# EAGLE design Main (EAGLE 9.5.2)
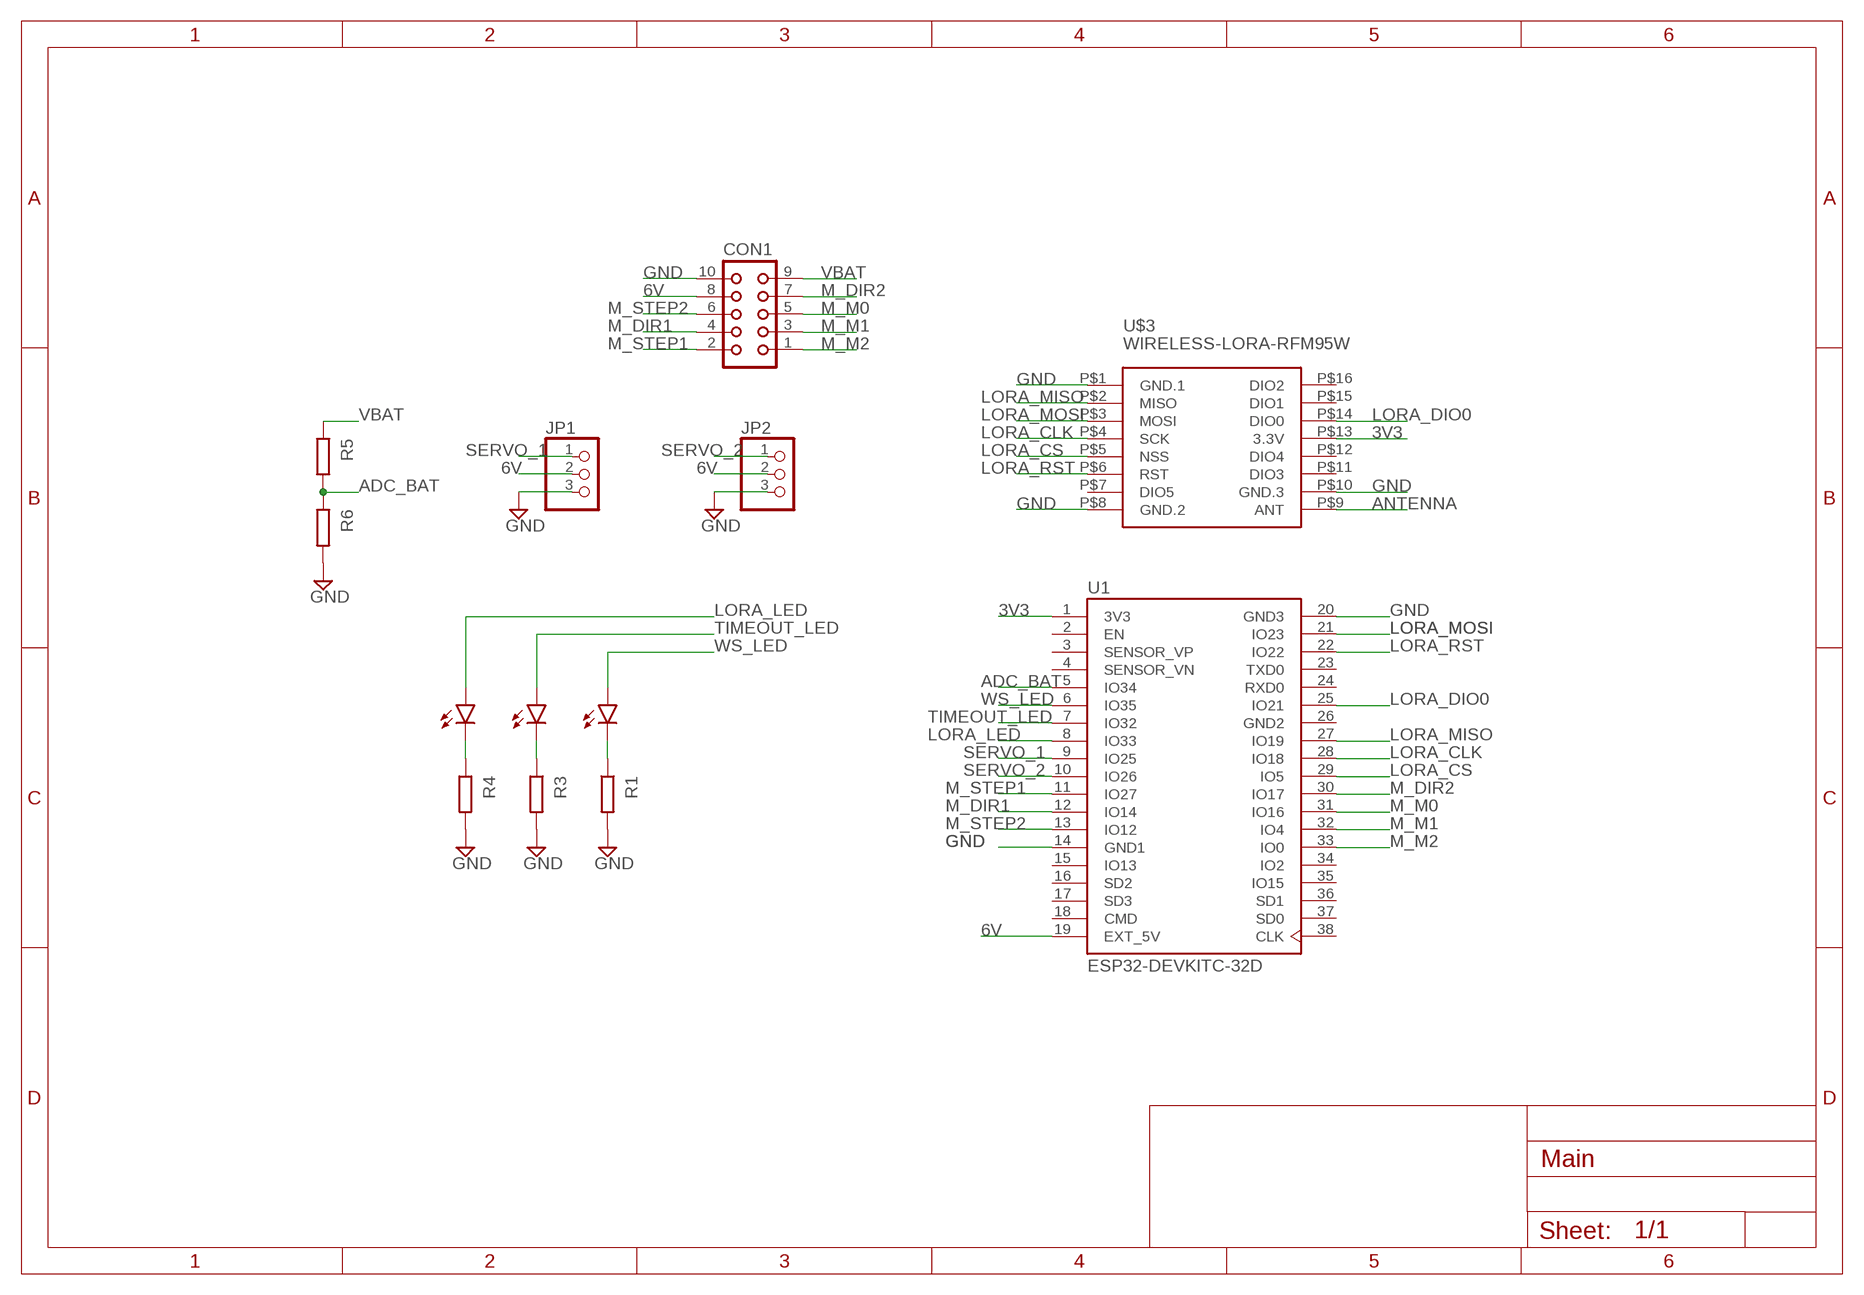
[diagram p0: schematic, sheet 1]

## Parts
CON1  CON10  [CON10]
JP1  PINHD-1X3  [1X03]
JP2  PINHD-1X3  [1X03]
LORA  LED_BLUE  [LEDRD254W60D565H860B_B]
MV  LED_BLUE  [LEDRD254W60D565H860B_B]
R1  R_CHIP-0603(1608-METRIC)  [RESC1608X60]
R3  R_CHIP-0603(1608-METRIC)  [RESC1608X60]
R4  R_CHIP-0603(1608-METRIC)  [RESC1608X60]
R5  R_CHIP-0603(1608-METRIC)  [RESC1608X60]
R6  R_CHIP-0603(1608-METRIC)  [RESC1608X60]
TOUT  LED_BLUE  [LEDRD254W60D565H860B_B]
U1  ESP32-DEVKITC-32D  [MODULE_ESP32-DEVKITC-32D]
U$3  WIRELESS-LORA-RFM95W  [LORA-BREAKOUT]

## Nets
3V3: U1.1(3V3) U$3.P$13(3.3V)
6V: CON1.8 JP1.2 JP2.2 U1.19(EXT_5V)
ADC_BAT: R5.2 R6.1 U1.5(IO34)
ANTENNA: U$3.P$9(ANT)
GND: CON1.10 JP1.3 JP2.3 R1.2 R3.2 R4.2 R6.2 U1.14(GND1) U1.20(GND3) U$3.P$1(GND.1) U$3.P$8(GND.2) U$3.P$10(GND.3)
LORA_CLK: U1.28(IO18) U$3.P$4(SCK)
LORA_CS: U1.29(IO5) U$3.P$5(NSS)
LORA_DIO0: U1.25(IO21) U$3.P$14(DIO0)
LORA_LED: MV.1(A) U1.8(IO33)
LORA_MISO: U1.27(IO19) U$3.P$2(MISO)
LORA_MOSI: U1.21(IO23) U$3.P$3(MOSI)
LORA_RST: U1.22(IO22) U$3.P$6(RST)
M_DIR1: CON1.4 U1.12(IO14)
M_DIR2: CON1.7 U1.30(IO17)
M_M0: CON1.5 U1.31(IO16)
M_M1: CON1.3 U1.32(IO4)
M_M2: CON1.1 U1.33(IO0)
M_STEP1: CON1.2 U1.11(IO27)
M_STEP2: CON1.6 U1.13(IO12)
N$1: R3.1 TOUT.2(C)
N$2: MV.2(C) R4.1
N$3: LORA.2(C) R1.1
SERVO_1: JP1.1 U1.9(IO25)
SERVO_2: JP2.1 U1.10(IO26)
TIMEOUT_LED: TOUT.1(A) U1.7(IO32)
VBAT: CON1.9 R5.1
WS_LED: LORA.1(A) U1.6(IO35)
Unconnected: U1.2(EN) U1.3(SENSOR_VP) U1.4(SENSOR_VN) U1.15(IO13) U1.16(SD2) U1.17(SD3) U1.18(CMD) U1.23(TXD0) U1.24(RXD0) U1.34(IO2) U1.35(IO15) U1.36(SD1) U1.37(SD0) U1.38(CLK) U$3.P$7(DIO5) U$3.P$11(DIO3) U$3.P$12(DIO4) U$3.P$15(DIO1) U$3.P$16(DIO2)

## Power pins joined to a net without a drawn wire
GND2: U1.26(GND2)

## Library data of the parts
CON1 = con-harting:CON10: CONNECTOR; OC_FARNELL: unknown; OC_NEWARK: unknown
JP1 JP2 = pinhead:PINHD-1X3: PIN HEADER
LORA MV TOUT = Opto-Electronic:LED: LED - Generic; CATEGORY: Opto-Electronic; SUB-CATEGORY: LED
R1 R3-R6 = Resistor:R: Resistor Fixed - Generic; CATEGORY: Resistor; SUB-CATEGORY: Fixed
U1 = custom:ESP32-DEVKITC-32D: Eval Board For Esp-Wroom-32; AVAILABILITY: Unavailable; DESCRIPTION: - Transceiver; 802.11 b/g/n _Wi-Fi, WiFi, WLAN_, Bluetooth® Smart Ready 4.x Dual Mode For Use With ESP-WROOM-32; MF: Espressif Systems; MP: ESP32-DEVKITC-32D; PACKAGE: None; PRICE: None
U$3 = mam2020:WIRELESS-LORA-RFM95W: 868/915 MHz LoRa Radio Transceiver Module based on SX1276 chip Click here to find device on ebay.com <http://www.ebay.com/sch/RFM95W+transceiver>

## Board
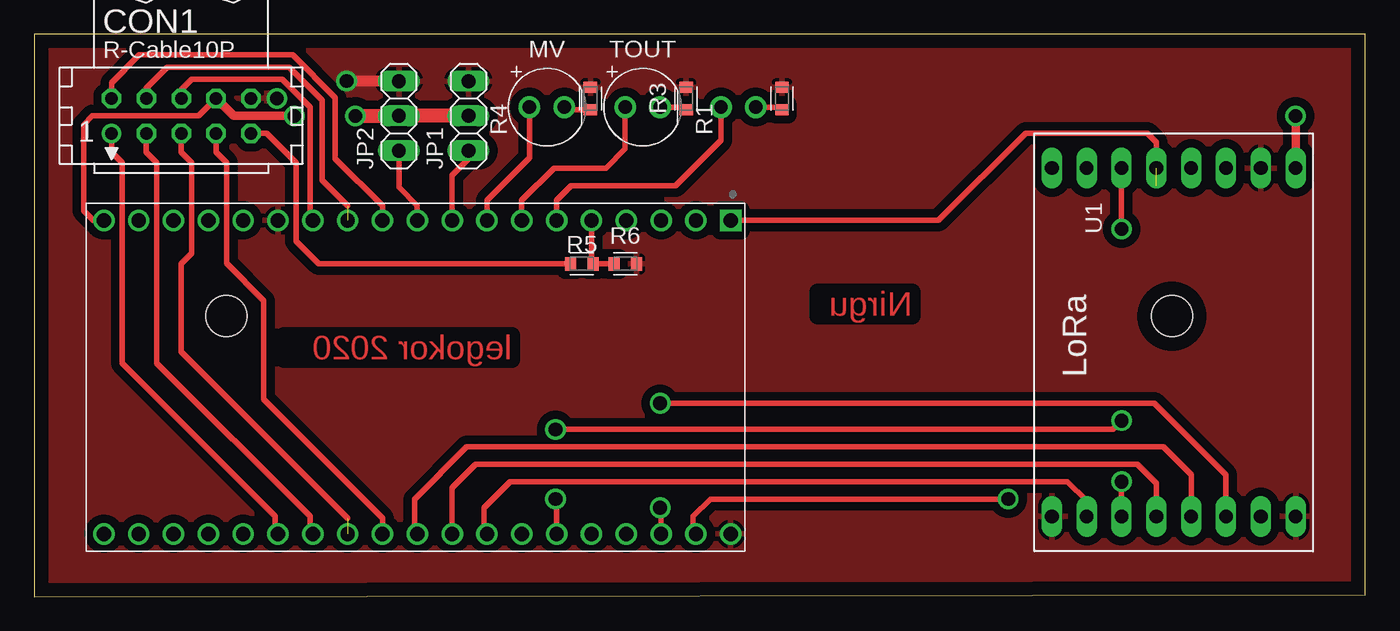
[diagram p1: board, top side]
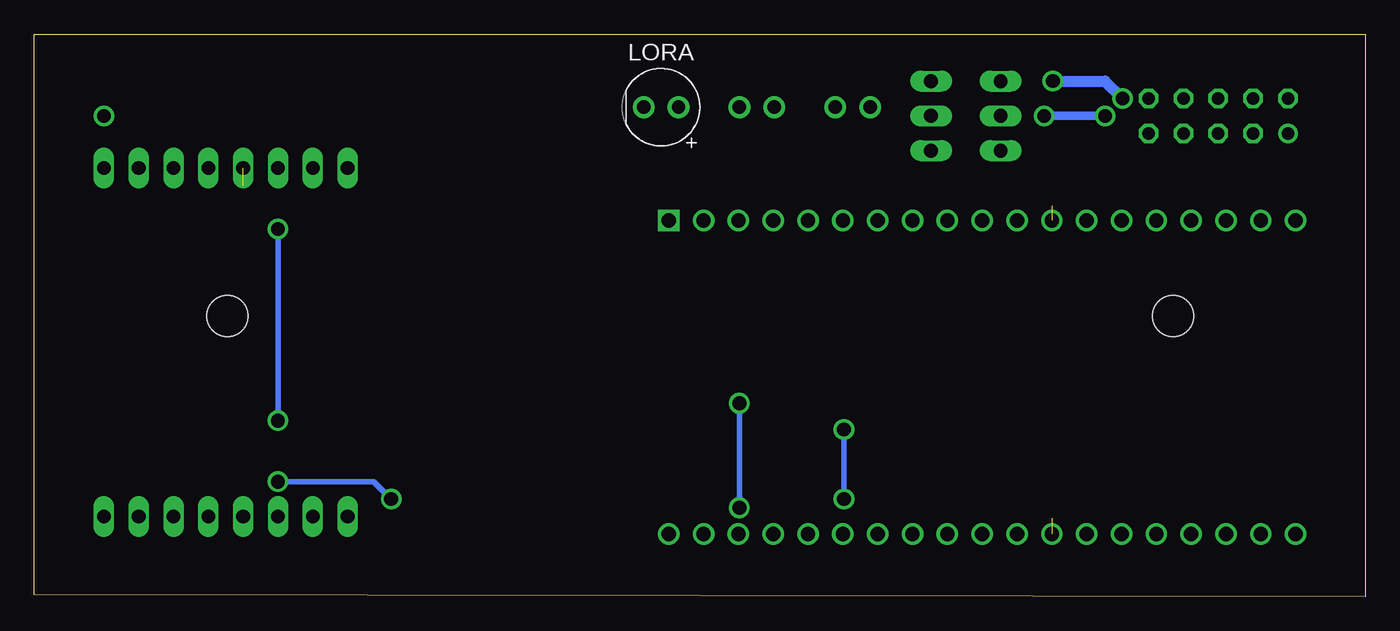
[diagram p2: board, bottom side, seen from below]

Size 97.08 x 41 mm. Coordinates in mm from the lower left corner, seen from the top.
Outline: 97.08,0.13 97.08,41 0,41 0,0 97.08,0.13
Copper layers (1*16): Top 0.035mm / dielectric 1.5mm / Bottom 0.035mm
Design rules "default": minimum track width 6mil, minimum drill 0.35mm, track to track 6mil, track to pad 6mil, pad to pad 6mil, via to via 6mil, smd to smd 6mil, copper to edge 40mil, drill to drill 6mil, minimum pad ring 10mil, minimum via ring 8mil, stop-mask expansion 4mil, vias tented up to drill 0mil, thermal gap 10mil
Holes 3 mm at 14.02,20.45 82.98,20.45

### Footprints (pad centres in the part's own frame; a part is rotated, then mirrored left to right if it is on the bottom)
CON10 = drill 0.914: 1 -5.08,-1.27 | drill 0.914 octagon: 2 -5.08,1.27; 3 -2.54,-1.27; 4 -2.54,1.27; 5 0,-1.27; 6 0,1.27; 7 2.54,-1.27; 8 2.54,1.27; 9 5.08,-1.27; 10 5.08,1.27
1X03 = drill 1.016 long: 1 -2.54,0; 2 0,0; 3 2.54,0
LEDRD254W60D565H860B_B = drill 0.981 pad 1.581: 1 -1.27,0; 2 1.27,0
RESC1608X60 = smd 0.799 x 0.974: 1 -0.815,0; 2 0.815,0
MODULE_ESP32-DEVKITC-32D = drill 1.04 square: 1 -12.7,19.76 | drill 1.04: 2 -12.7,17.22; 3 -12.7,14.68; 4 -12.7,12.14; 5 -12.7,9.6; 6 -12.7,7.06; 7 -12.7,4.52; 8 -12.7,1.98; 9 -12.7,-0.56; 10 -12.7,-3.1; 11 -12.7,-5.64; 12 -12.7,-8.18; 13 -12.7,-10.72; 14 -12.7,-13.26; 15 -12.7,-15.8; 16 -12.7,-18.34; 17 -12.7,-20.88; 18 -12.7,-23.42; 19 -12.7,-25.96; 20 10.16,19.76; 21 10.16,17.22; 22 10.16,14.68; 23 10.16,12.14; 24 10.16,9.6; 25 10.16,7.06; 26 10.16,4.52; 27 10.16,1.98; 28 10.16,-0.56; 29 10.16,-3.1; 30 10.16,-5.64; 31 10.16,-8.18; 32 10.16,-10.72; 33 10.16,-13.26; 34 10.16,-15.8; 35 10.16,-18.34; 36 10.16,-20.88; 37 10.16,-23.42; 38 10.16,-25.96
LORA-BREAKOUT = drill 1 long: P$1 -12.7,7.62; P$2 -12.7,5.08; P$3 -12.7,2.54; P$4 -12.7,0; P$5 -12.7,-2.54; P$6 -12.7,-5.08; P$7 -12.7,-7.62; P$8 -12.7,-10.16; P$9 12.7,-10.16; P$10 12.7,-7.62; P$11 12.7,-5.08; P$12 12.7,-2.54; P$13 12.7,0; P$14 12.7,2.54; P$15 12.7,5.08; P$16 12.7,7.62

### Placement (x,y rotation side)
CON1  10.72,35.05 0 top
JP1  31.67,35.05 90 top
JP2  26.59,35.05 90 top
LORA  51.36,35.69 180 bottom
MV  37.39,35.69 0 top
R1  54.53,36.32 90 top
R3  47.55,36.32 90 top
R4  40.56,36.32 90 top
R5  39.93,24.26 0 top
R6  43.1,24.26 0 top
TOUT  44.37,35.69 0 top
U1  31.04,14.73 270 top
U$3  81.84,18.54 90 top

### Tracks (layer width: path | path; a pad name or v marks a point on that pad's centre or on a via)
3V3  (1 unrouted)
  Top 0.406: U1.1 65.96,27.43 72.31,33.78 81.2,33.78 81.84,33.15 81.84,29.97
6V  (via drill 1)
  Top 0.406: U1.19 4.32,27.43 3.61,28.14 3.61,34.42 4.24,35.05 11.99,35.05 CON1.8
  Top 0.61: CON1.8 14.53,35.05 v18.97,35.05
  Top 0.813: 27.23,35.05 JP2.2
  Top 1.016: JP1.2 JP2.2 v23.42,35.05
  Bottom 0.61: v18.97,35.05 v23.42,35.05
ADC_BAT
  Top 0.406: R6.1 R5.2 40.64,24.36 U1.5
ANTENNA  (via drill 1)
  Top 0.61: U$3.P$9 v92,35.05
GND  (via drill 1)
  Top 0.813: JP2.3 v22.78,37.59
  Bottom 0.813: v22.78,37.59 18.97,37.59 v17.7,36.32
  pour Top (isolate 0.61): -0.08,0.13 -0.08,41.13 97.08,41.13 97.08,0.13
LORA_CLK
  Top 0.406: U1.28 30.48,7.95 32.18,9.65 80.44,9.65 81.84,8.26 U$3.P$4
LORA_CS
  Top 0.406: U1.29 27.74,4.77 27.74,7.11 31.55,10.92 82.35,10.92 84.38,8.89 U$3.P$5
LORA_DIO0  (via drill 1)
  Top 0.406: v79.3,12.83 78.66,12.19 v38.02,12.19 | v38.02,7.11 38.1,7.04 U1.25 | U$3.P$14 v79.3,26.8
  Bottom 0.406: v38.02,12.19 v38.02,7.11 | v79.3,26.8 v79.3,12.83
LORA_LED
  Top 0.406: U1.8 33.02,28.9 36.12,32 MV.1
LORA_MISO
  Top 0.406: U1.27 32.82,4.77 32.82,6.48 34.72,8.38 75.36,8.38 76.76,6.98 U$3.P$2
LORA_MOSI  (via drill 1)
  Top 0.406: v79.3,8.38 U$3.P$3 | U1.21 48.06,4.77 48.06,5.84 49.33,7.11 v71.04,7.11
  Bottom 0.406: v79.3,8.38 72.31,8.38 v71.04,7.11
LORA_RST  (via drill 1)
  Top 0.406: U$3.P$6 86.92,8.89 81.71,14.1 v45.64,14.1 | v45.64,6.48 45.72,6.4 U1.22
  Bottom 0.406: v45.64,14.1 v45.64,6.48
M_DIR1  (1 unrouted)
  Top 0.406: CON1.4 8.18,37.08 9.7,38.61 18.59,38.61 21.01,36.2 21.01,30.35 22.86,28.5
M_DIR2
  Top 0.406: U1.30 25.4,5.71 16.74,14.38 16.74,21.57 14.02,24.29 14.02,31.62 13.26,32.39 CON1.7
M_M0  (1 unrouted)
  Top 0.406: CON1.5 10.72,32.39 11.48,31.62 11.48,25.02 10.72,24.26 10.72,17.86 22.86,5.71
M_M1
  Top 0.406: U1.32 20.12,4.77 20.12,5.84 8.94,17.02 8.94,31.62 8.18,32.39 CON1.3
M_M2
  Top 0.406: U1.33 17.58,4.77 17.58,5.84 6.4,17.02 6.4,31.62 5.64,32.39 CON1.1
M_STEP1
  Top 0.406: U1.11 25.4,28.5 21.96,31.94 21.96,36.39 18.85,39.5 7.67,39.5 5.64,37.47 CON1.2
M_STEP2
  Top 0.406: U1.13 20.12,27.63 20.12,35.69 18.09,37.72 11.48,37.72 10.72,36.96 CON1.6
N$1
  Top 0.406: TOUT.2 47.53,35.69 R3.1
N$2
  Top 0.406: R4.1 38.85,35.49 MV.2
N$3
  Top 0.406: R1.1 54.51,35.69 LORA.2
SERVO_1
  Top 0.406: JP1.1 31.67,31.93 30.48,30.73 U1.9
SERVO_2
  Top 0.406: JP2.1 26.59,29.84 27.94,28.5 U1.10
TIMEOUT_LED
  Top 0.406: U1.7 35.56,28.9 37.9,31.24 41.71,31.24 43.1,32.64 TOUT.1
VBAT
  Top 0.406: CON1.9 16.94,33.78 19.1,31.62 19.1,25.91 20.75,24.26 R5.1
WS_LED
  Top 0.406: U1.6 38.1,28.9 39.17,29.97 46.79,29.97 50.09,33.27 LORA.1

### Text on the board
Top: Nirgu | legokor 2020